# EAGLE design AFM_QFM_sensor (EAGLE 9.6.2)
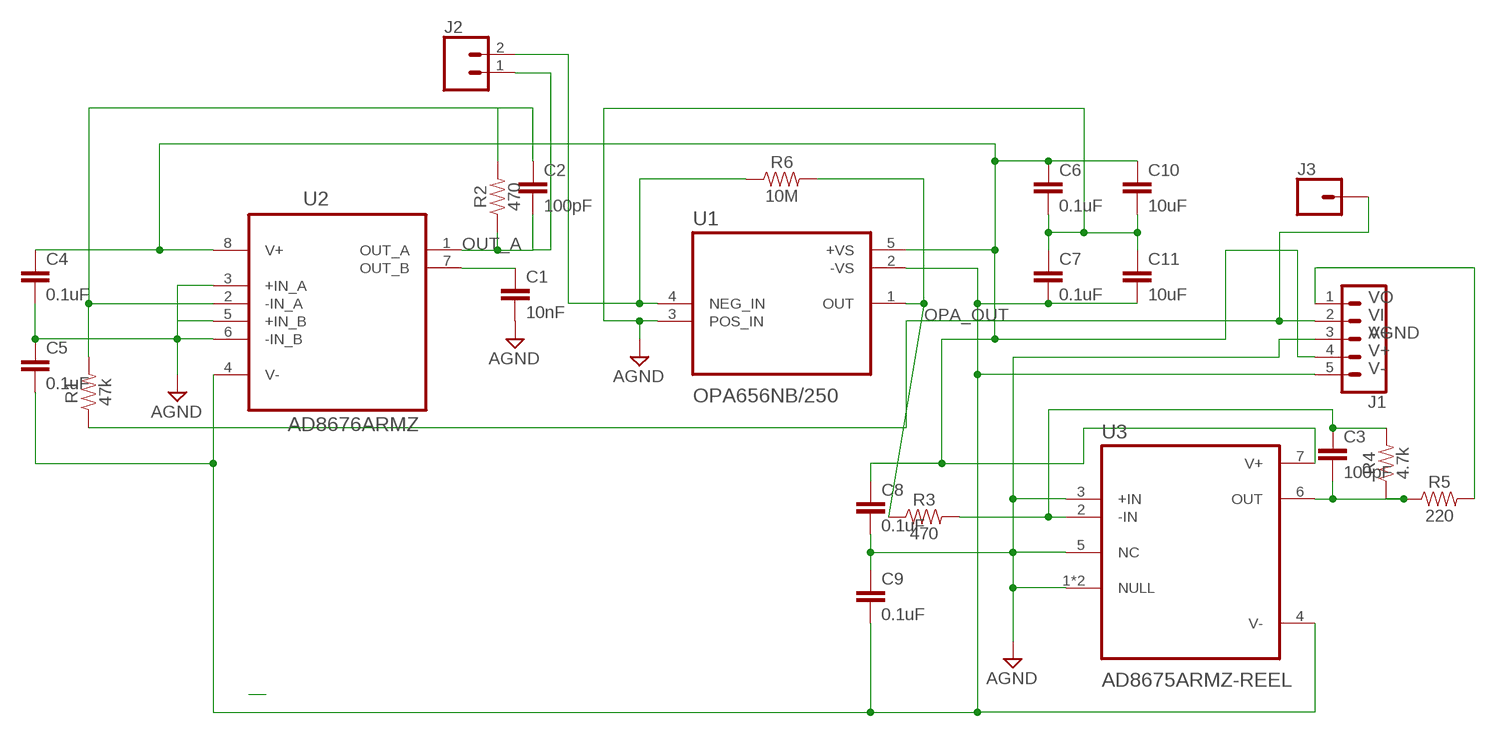
[diagram p0: schematic, sheet 1]

## Parts
C1  10nF  10NF-0603-50V-10%  [0603]
C2  100pF  100PF-0603-50V-5%  [0603]
C3  100pF  100PF-0603-50V-5%  [0603]
C4  0.1uF  0.1UF-0603-25V-(+80/-20%)  [0603]
C5  0.1uF  0.1UF-0603-25V-(+80/-20%)  [0603]
C6  0.1uF  0.1UF-0603-25V-(+80/-20%)  [0603]
C7  0.1uF  0.1UF-0603-25V-(+80/-20%)  [0603]
C8  0.1uF  0.1UF-0603-25V-(+80/-20%)  [0603]
C9  0.1uF  0.1UF-0603-25V-(+80/-20%)  [0603]
C10  10uF  10UF-0805-10V-10%  [0805]
C11  10uF  10UF-0805-10V-10%  [0805]
J1  CONN_05PTH_LONGPADS  [1X05_LONGPADS]
J2  CONN_02PTH3  [1X02_LONGPADS]
J3  CONN_01PTH_LONGPAD  [1X01_LONGPAD]
R1  47k  47KOHM-0603-1/10W-1%  [0603]
R2  470  47OHM-0603-1/10W-1%  [0603]
R3  470  470OHM-0603-1/10W-1%  [0603]
R4  4.7k  4.7KOHM-0603-1/10W-1%  [0603]
R5  220  220OHM-0603-1/10W-1%  [0603]
R6  10M  1MOHM-0603-1/4W-5%  [0603]
U1  OPA656NB/250  [SOT95P280X145-5N]
U2  AD8676ARMZ  [SOP65P490X110-8N]
U3  AD8675ARMZ-REEL  [SOP65P490X110-8N]

## Nets
AGND: C1.2 C4.2 C5.1 C6.2 C7.1 C8.2 C9.1 C10.2 C11.1 J1.3 U1.3(POS_IN) U2.3(+IN_A) U2.5(+IN_B) U2.6(-IN_B) U3.1(NULL) U3.3(+IN) U3.5(NC) U3.8(NULL)
N$3: J2.2 R6.1 U1.4(NEG_IN)
N$6: C1.1 U2.7(OUT_B)
N$7: C2.1 R1.2 R2.2 U2.2(-IN_A)
N$8: C3.2 R4.1 R5.1 U3.6(OUT)
OPA_OUT: C3.1 R3.1 R3.2 R4.2 R6.2 U1.1(OUT) U3.2(-IN)
OUT_A: C2.2 J2.1 R2.1 U2.1(OUT_A)
V+: C4.1 C6.1 C8.1 C10.1 J1.4 U1.5(+VS) U2.8(V+) U3.7(V+)
V-: C5.2 C7.2 C9.2 C11.2 J1.5 U1.2(-VS) U2.4(V-) U3.4(V-)
VI: J1.2 J3.1 R1.1
VO: J1.1 R5.2

## Library data of the parts
C1 = SparkFun-Capacitors:10NF: 0.01uF/10nF/10,000pF ceramic capacitors A capacitor is a passive two-terminal electrical component used to store electrical energy temporarily in an electric field. CAP-09321; PROD_ID: CAP-00867
C2 C3 = SparkFun-Capacitors:100PF: 100pF/0.1nF ceramic capacitors A capacitor is a passive two-terminal electrical component used to store electrical energy temporarily in an electric field.; PROD_ID: CAP-07883
C4-C9 = SparkFun-Capacitors:0.1UF: 0.1µF ceramic capacitors A capacitor is a passive two-terminal electrical component used to store electrical energy temporarily in an electric field.; PROD_ID: CAP-00810
C10 C11 = SparkFun-Capacitors:10UF: 10.0µF ceramic capacitors A capacitor is a passive two-terminal electrical component used to store electrical energy temporarily in an electric field.; PROD_ID: CAP-11330
J1 = SparkFun-Connectors:CONN_05: Multi connection point. Often used as Generic Header-pin footprint for 0.1 inch spaced/style header connections On any of the 0.1 inch spaced packages, you can populate with these: Break Away Headers - Straight <https://www.sparkfun.com/products/116> (PRT-00116) Break Away Male Headers - Right Angle <https://www.sparkfun.com/products/553> (PRT-00553) Female Headers <https://www.sparkfun.com/products/115> (PRT-00115) Break Away Headers - Machine Pin <https://www.sparkfun.com/products/117> (PRT-00117) Break Away Female Headers - Swiss Machine Pin <https://www.sparkfun.com/products/743> (PRT-00743) For SCREWTERMINALS and SPRING TERMINALS visit here: Screw Terimnals on SparkFun.com <https://www.sparkfun.com/search/results?term=Screw+Terminals> (5mm/3.5mm/2.54mm spacing) This device is also useful as a general connection point to wire up your design to another part of your project. Our various solder wires solder well into these plated through hole pads. Hook-Up Wire - Assortment (Stranded, 22 AWG) <https://www.sparkfun.com/products/11375> (PRT-11375) Hook-Up Wire - Assortment (Solid Core, 22 AWG) <https://www.sparkfun.com/products/11367> (PRT-11367) View the entire wire category on our website here <https://www.sparkfun.com/categories/141> Special notes: Molex polarized connector foot print use with SKU : PRT-08231 with associated crimp pins and housings. 1MM SMD Version SKU: PRT-10208
J2 = SparkFun-Connectors:CONN_02: Multi connection point. Often used as Generic Header-pin footprint for 0.1 inch spaced/style header connections On any of the 0.1 inch spaced packages, you can populate with these: Break Away Headers - Straight <https://www.sparkfun.com/products/116> (PRT-00116) Break Away Male Headers - Right Angle <https://www.sparkfun.com/products/553> (PRT-00553) Female Headers <https://www.sparkfun.com/products/115> (PRT-00115) Break Away Headers - Machine Pin <https://www.sparkfun.com/products/117> (PRT-00117) Break Away Female Headers - Swiss Machine Pin <https://www.sparkfun.com/products/743> (PRT-00743) For SCREWTERMINALS and SPRING TERMINALS visit here: Screw Terimnals on SparkFun.com <https://www.sparkfun.com/search/results?term=Screw+Terminals> (5mm/3.5mm/2.54mm spacing) This device is also useful as a general connection point to wire up your design to another part of your project. Our various solder wires solder well into these plated through hole pads. Hook-Up Wire - Assortment (Stranded, 22 AWG) <https://www.sparkfun.com/products/11375> (PRT-11375) Hook-Up Wire - Assortment (Solid Core, 22 AWG) <https://www.sparkfun.com/products/11367> (PRT-11367) View the entire wire category on our website here <https://www.sparkfun.com/categories/141> Special notes: Molex polarized connector foot print use with: PRT-08233 with associated crimp pins and housings. 2.54_SCREWTERM for use with PRT-10571. 3.5mm Screw Terminal footprints for PRT-08084 5mm Screw Terminal footprints for use with PRT-08432
J3 = SparkFun-Connectors:CONN_01: Single connection point. Often used as Generic Header-pin footprint for 0.1 inch spaced/style header connections On any of the 0.1 inch spaced packages, you can populate with these: Break Away Headers - Straight <https://www.sparkfun.com/products/116> (PRT-00116) Break Away Male Headers - Right Angle <https://www.sparkfun.com/products/553> (PRT-00553) Female Headers <https://www.sparkfun.com/products/115> (PRT-00115) Break Away Headers - Machine Pin <https://www.sparkfun.com/products/117> (PRT-00117) Break Away Female Headers - Swiss Machine Pin <https://www.sparkfun.com/products/743> (PRT-00743) This device is also useful as a general connection point to wire up your design to another part of your project. Our various solder wires solder well into these plated through hole pads. Hook-Up Wire - Assortment (Stranded, 22 AWG) <https://www.sparkfun.com/products/11375> (PRT-11375) Hook-Up Wire - Assortment (Solid Core, 22 AWG) <https://www.sparkfun.com/products/11367> (PRT-11367) View the entire wire category on our website here <https://www.sparkfun.com/categories/141> Special notes: SMTSO-256-ET is a "flush mount" nut for a 4-40 screw. We mostly use this on specialty testbeds; it is a nice way to connect hardware to your PCB at an adjustable hieght. Also note, the SNAP packages are for using a snappable style connector. We sell a baggie of snaps and they are also used on two LilyPad designs: Snap Assortment - 30 pack (male and female) <https://www.sparkfun.com/products/11347> (DEV-11347) LilyPad Arduino SimpleSnap <https://www.sparkfun.com/products/10941> (DEV-10941) LilyPad SimpleSnap Protoboard <https://www.sparkfun.com/products/10940> (DEV-10940)
R1 = SparkFun-Resistors:47KOHM: 47kΩ resistor A resistor is a passive two-terminal electrical component that implements electrical resistance as a circuit element. Resistors act to reduce current flow, and, at the same time, act to lower voltage levels within circuits. - Wikipedia; PROD_ID: RES-07871
R2 = SparkFun-Resistors:47OHM: 47Ω resistor A resistor is a passive two-terminal electrical component that implements electrical resistance as a circuit element. Resistors act to reduce current flow, and, at the same time, act to lower voltage levels within circuits. - Wikipedia; PROD_ID: RES-14282; VALUE: 47
R3 = SparkFun-Resistors:470OHM: 470Ω resistor A resistor is a passive two-terminal electrical component that implements electrical resistance as a circuit element. Resistors act to reduce current flow, and, at the same time, act to lower voltage levels within circuits. - Wikipedia; PROD_ID: RES-07869
R4 = SparkFun-Resistors:4.7KOHM: 4.7kΩ resistor A resistor is a passive two-terminal electrical component that implements electrical resistance as a circuit element. Resistors act to reduce current flow, and, at the same time, act to lower voltage levels within circuits. - Wikipedia; PROD_ID: RES-07857
R5 = SparkFun-Resistors:220OHM: 220Ω resistor A resistor is a passive two-terminal electrical component that implements electrical resistance as a circuit element. Resistors act to reduce current flow, and, at the same time, act to lower voltage levels within circuits. - Wikipedia; PROD_ID: RES-07861
R6 = SparkFun-Resistors:1MOHM: 1MΩ resistor A resistor is a passive two-terminal electrical component that implements electrical resistance as a circuit element. Resistors act to reduce current flow, and, at the same time, act to lower voltage levels within circuits. - Wikipedia; PROD_ID: RES-07868; VALUE: 1M
U1 = OPA656NB_250:OPA656NB/250: Check availability <https://pricing.snapeda.com/parts/OPA656NB/250/Texas%20Instruments/view-part?ref=eda>; AVAILABILITY: In Stock; CHECK_PRICES: https://www.snapeda.com/parts/OPA656NB/250/Texas+Instruments/view-part/?ref=eda; DESCRIPTION: Wideband, Unity Gain Stable FET-Input Operational Amplifier; MF: Texas Instruments; MP: OPA656NB/250; PACKAGE: SOT-23-5 Texas Instruments; PRICE: None; PURCHASE-URL: https://www.snapeda.com/api/url_track_click_mouser/?unipart_id=911932&manufacturer=Texas Instruments&part_name=OPA656NB/250&search_term=opa656; SNAPEDA_LINK: https://www.snapeda.com/parts/OPA656NB/250/Texas+Instruments/view-part/?ref=snap
U2 = AD8676ARMZ:AD8676ARMZ: Dual Rail-to-Rail Output Op Amp Check availability <https://pricing.snapeda.com/parts/AD8676ARMZ/Analog%20Devices/view-part?ref=eda>; AVAILABILITY: In Stock; CHECK_PRICES: https://www.snapeda.com/parts/AD8676ARMZ/Analog+Devices/view-part/?ref=eda; DESCRIPTION: Ultra Precision, 36 V, 2.8 nV/√Hz Dual RRO Op Amp; MF: Analog Devices; MP: AD8676ARMZ; PACKAGE: MSOP-8 Analog Devices; PRICE: None; PURCHASE-URL: https://www.snapeda.com/api/url_track_click_mouser/?unipart_id=599467&manufacturer=Analog Devices&part_name=AD8676ARMZ&search_term=ad8676; SNAPEDA_LINK: https://www.snapeda.com/parts/AD8676ARMZ/Analog+Devices/view-part/?ref=snap
U3 = AD8675ARMZ-REEL:AD8675ARMZ-REEL: Check availability <https://pricing.snapeda.com/parts/AD8675ARMZ/Analog%20Devices/view-part?ref=eda>; AVAILABILITY: In Stock; CHECK_PRICES: https://www.snapeda.com/parts/AD8675ARMZ/Analog+Devices/view-part/?ref=eda; DESCRIPTION: 36 V Precision, 2.8 nV/√Hz Rail-to-Rail Output Op Amp; MF: Analog Devices; MP: AD8675ARMZ; PACKAGE: MSOP-8 Analog Devices; PRICE: None; PURCHASE-URL: https://www.snapeda.com/api/url_track_click_mouser/?unipart_id=570787&manufacturer=Analog Devices&part_name=AD8675ARMZ&search_term=ad8675; SNAPEDA_LINK: https://www.snapeda.com/parts/AD8675ARMZ/Analog+Devices/view-part/?ref=snap

## Board
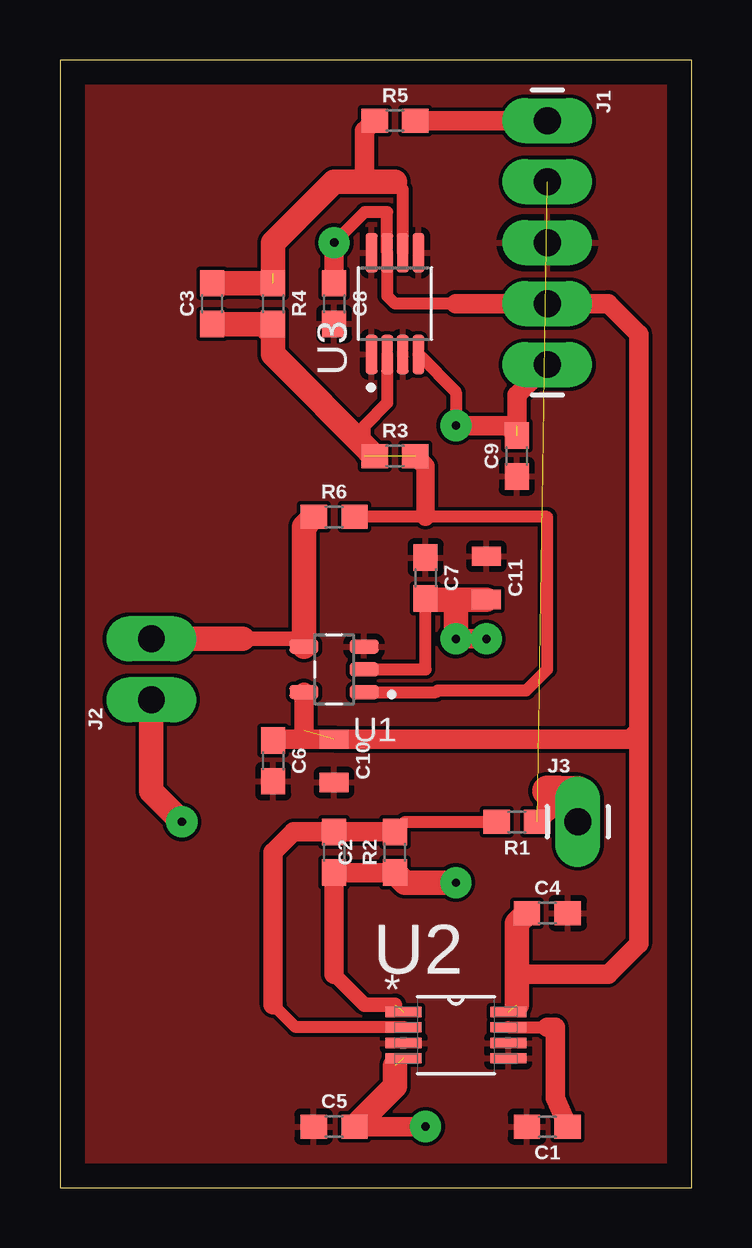
[diagram p1: board, top side]
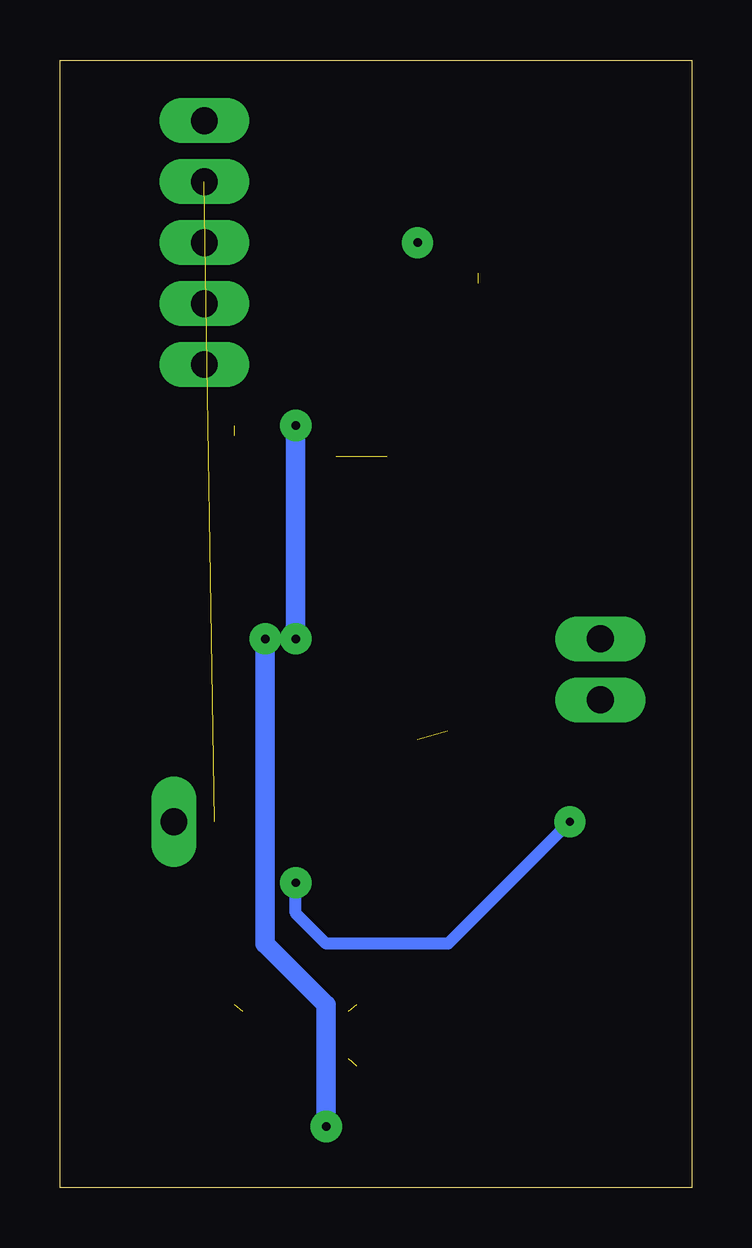
[diagram p2: board, bottom side, seen from below]

Size 26.34 x 46.98 mm. Coordinates in mm from the lower left corner, seen from the top.
Outline: 0,0 26.34,0 26.34,46.98 0,46.98 0,0
Copper layers (1*16): Top 0.035mm / dielectric 1.5mm / Bottom 0.035mm
Design rules "default": minimum track width 6mil, minimum drill 0.35mm, track to track 6mil, track to pad 6mil, pad to pad 6mil, via to via 6mil, smd to smd 6mil, copper to edge 40mil, drill to drill 6mil, minimum pad ring 10mil, minimum via ring 8mil, stop-mask expansion 4mil, vias tented up to drill 0mil, thermal gap 10mil

### Footprints (pad centres in the part's own frame; a part is rotated, then mirrored left to right if it is on the bottom)
0603 = smd 1.1 x 1: 1 -0.85,0; 2 0.85,0
0805 = smd 0.8 x 1.2: 1 -0.9,0; 2 0.9,0
1X05_LONGPADS = drill 1.118 pad 1.88 long: 1 0,0; 2 2.54,0; 3 5.08,0; 4 7.62,0; 5 10.16,0
1X02_LONGPADS = drill 1.118 pad 1.88 long: 1 0,0; 2 2.54,0
1X01_LONGPAD = drill 1.118 pad 1.88 long: 1 0,0
SOT95P280X145-5N = smd 1.21 x 0.59: 1 -1.255,0.95; 2 -1.255,0; 3 -1.255,-0.95; 4 1.255,-0.95; 5 1.255,0.95
SOP65P490X110-8N = smd 1.499 x 0.432: 1 -2.184,0.965; 2 -2.184,0.33; 3 -2.184,-0.33; 4 -2.184,-0.965; 5 2.184,-0.965; 6 2.184,-0.33; 7 2.184,0.33; 8 2.184,0.965
SOP65P490X110-8N' = smd 1.62 x 0.48: 1 -2.12,0.975; 2 -2.12,0.325; 3 -2.12,-0.325; 4 -2.12,-0.975; 5 2.12,-0.975; 6 2.12,-0.325; 7 2.12,0.325; 8 2.12,0.975

### Placement (x,y rotation side)
C1  20.32,2.54 180 top
C2  11.43,13.97 270 top
C3  6.35,36.83 90 top
C4  20.32,11.43 0 top
C5  11.43,2.54 0 top
C6  8.89,17.78 270 top
C7  15.24,25.4 270 top
C8  11.43,36.83 270 top
C9  19.05,30.48 90 top
C10  11.43,17.78 270 top
C11  17.78,25.4 270 top
J1  20.32,44.45 270 top
J2  3.81,20.32 90 top
J3  21.59,15.24 0 top
R1  19.05,15.24 180 top
R2  13.97,13.97 90 top
R3  13.97,30.48 0 top
R4  8.89,36.83 270 top
R5  13.97,44.45 0 top
R6  11.43,27.94 0 top
U1  11.43,21.59 180 top
U2  16.51,6.35 0 top
U3  AD8675ARMZ-REEL  [SOP65P490X110-8N']  13.97,36.83 90 top

### Tracks (layer width: path | path; a pad name or v marks a point on that pad's centre or on a via)
AGND
  pour Top (isolate 0.1, rank 6): 26.67,45.72 26.67,0 1.27,0 0,1.27 0,46.99 26.67,46.99
N$3
  Top 0.61: U1.4 9.86,22.86 7.62,22.86 5.08,22.86
  Top 1.016: J2.2 7.62,22.86 | U1.4 10.17,27.54 R6.1
N$6
  Top 0.508: U2.7 20.32,6.68
  Top 0.813: 20.32,6.68 20.65,6.68 20.65,3.72 C1.1
N$7
  Top 0.508: R2.2 14.39,15.24 R1.2 | U2.2 9.83,6.68 8.89,7.62
  Top 0.813: 8.89,7.62 8.89,13.97 9.74,14.82 C2.1 R2.2
N$8  (1 unrouted)
  Top 0.508: U3.6 14.29,41.59 13.97,41.91
  Top 0.813: R5.1 12.7,44.03 12.7,41.91
  Top 1.016: C3.2 R4.1 | 13.97,41.91 12.7,41.91 11.43,41.91 8.89,39.37 8.89,38.1
OPA_OUT  (2 unrouted)
  Top 0.508: U1.1 15.68,20.64 15.75,20.71 19.44,20.71 20.32,21.59 20.32,27.94 15.24,27.94 R6.2 | U3.2 13.64,32.7 12.7,31.75 12.7,30.48
  Top 0.762: R3.2 15.24,30.06 15.24,27.94
  Top 1.016: R3.1 8.89,34.71 8.89,35.56 8.47,35.98 C3.1 R4.2
OUT_A  (via drill 0.35 pad 1.3)  (1 unrouted)
  Top 0.61: 11.43,8.89 12.7,7.62 13.97,7.62
  Top 0.813: R2.1 C2.2 11.43,8.89
  Top 1.016: v16.51,12.7 14.39,12.7 R2.1 | v5.08,15.24 3.81,16.51 J2.1
  Bottom 0.508: v5.08,15.24 10.16,10.16 15.24,10.16 16.51,11.43 v16.51,12.7
V+  (via drill 0.35 pad 1.3)  (2 unrouted)
  Top 0.508: v11.43,39.37 12.7,40.64 13.64,40.64 U3.7 13.64,37.16 13.97,36.83 16.51,36.83
  Top 0.813: 24.13,19.05 24.13,35.56 22.86,36.83 J1.4 16.51,36.83 | U1.5 10.17,19.04 | C6.1 8.94,18.68 C10.1 23.76,18.68 24.13,19.05 | C8.1 v11.43,39.37 | 19.05,8.89 22.86,8.89 24.13,10.16 24.13,19.05
  Top 1.016: C4.1 19.05,11.01 19.05,8.89 19.05,7.62
V-  (via drill 0.35 pad 1.3)  (2 unrouted)
  Top 0.508: U1.2 15.24,21.59 C7.2 | U3.4 16.51,33.15 v16.51,31.75
  Top 0.813: C9.2 18.63,31.75 v16.51,31.75 | v16.51,22.86 v17.78,22.86 | v15.24,2.54 12.7,2.54 12.49,2.75 | J1.5 19.05,33.02 19.05,31.75
  Top 1.016: C5.2 12.49,2.75 13.97,4.23 13.97,5.08 | C11.2 16.51,24.5 | 16.51,24.5 15.29,24.5 C7.2 | v16.51,22.86 16.51,24.5
  Bottom 0.813: v16.51,31.75 v16.51,22.86 | v15.24,2.54 15.24,7.62 17.78,10.16 v17.78,22.86
VI  (1 unrouted)
  Top 0.813: R1.1 20.32,15.66 20.32,16.53 | J3.1 21.59,16.51
  Top 1.27: 21.59,16.51 20.79,16.51 20.78,16.53 20.32,16.53
VO
  Top 0.813: R5.2 J1.1